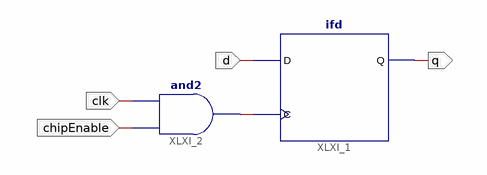
[diagram p0: schematic sheet 1]
// Xilinx ISE schematic fdce1.sch (artix7) as structural Verilog: 2 symbols, 4 ports
module fdce1 (
  input  clk,
  input  chipEnable,
  input  d,
  output q
);

  wire XLXN_1;

  ifd XLXI_1 (.C(XLXN_1), .D(d), .Q(q));
  and XLXI_2 (XLXN_1, chipEnable, clk);
endmodule
